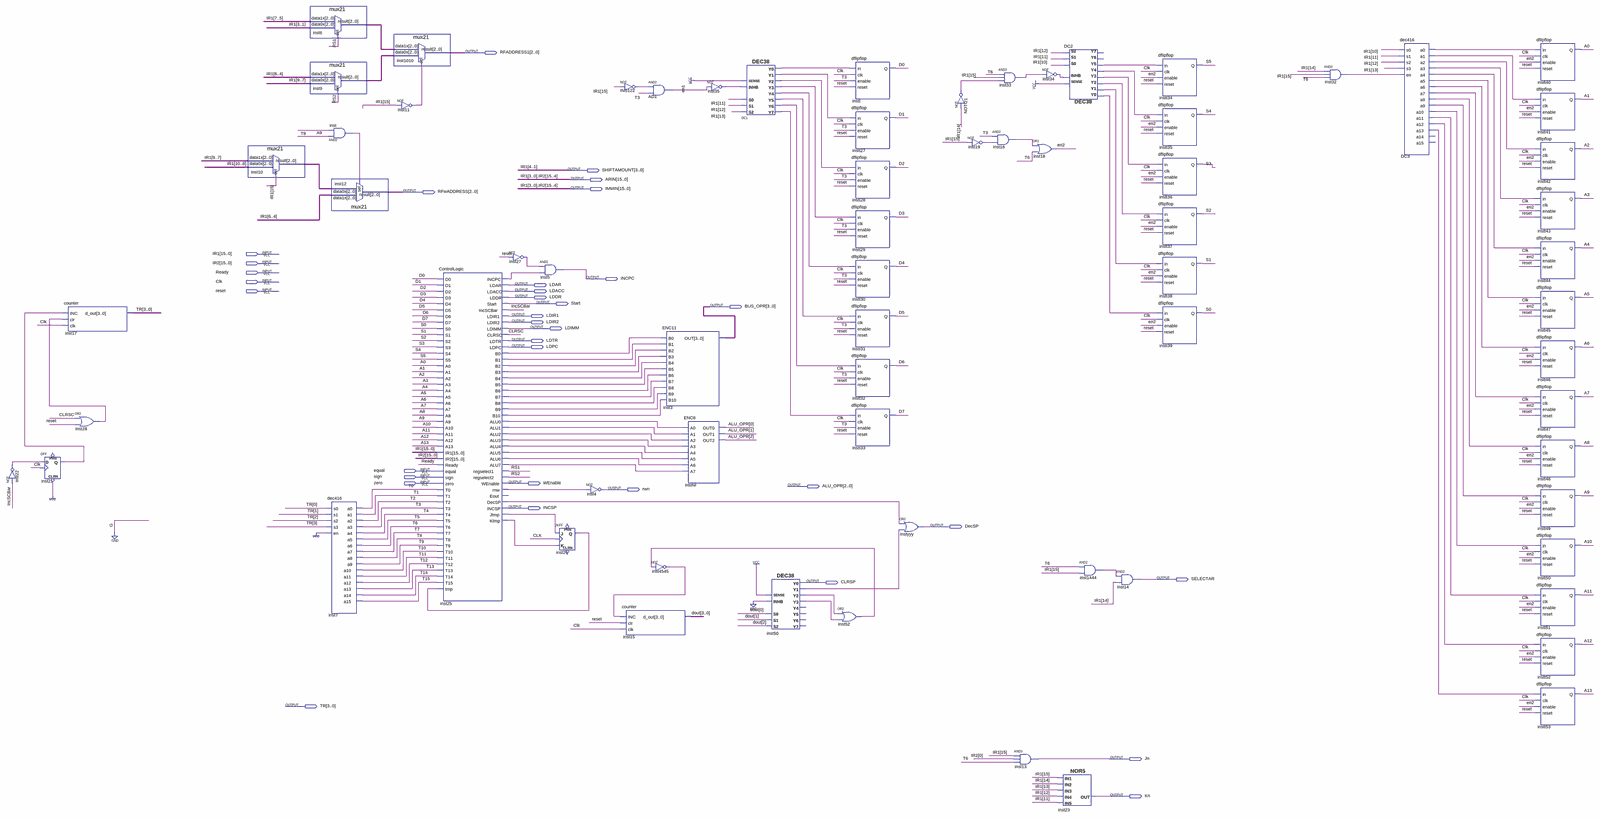
[diagram p0: schematic sheet, whole]
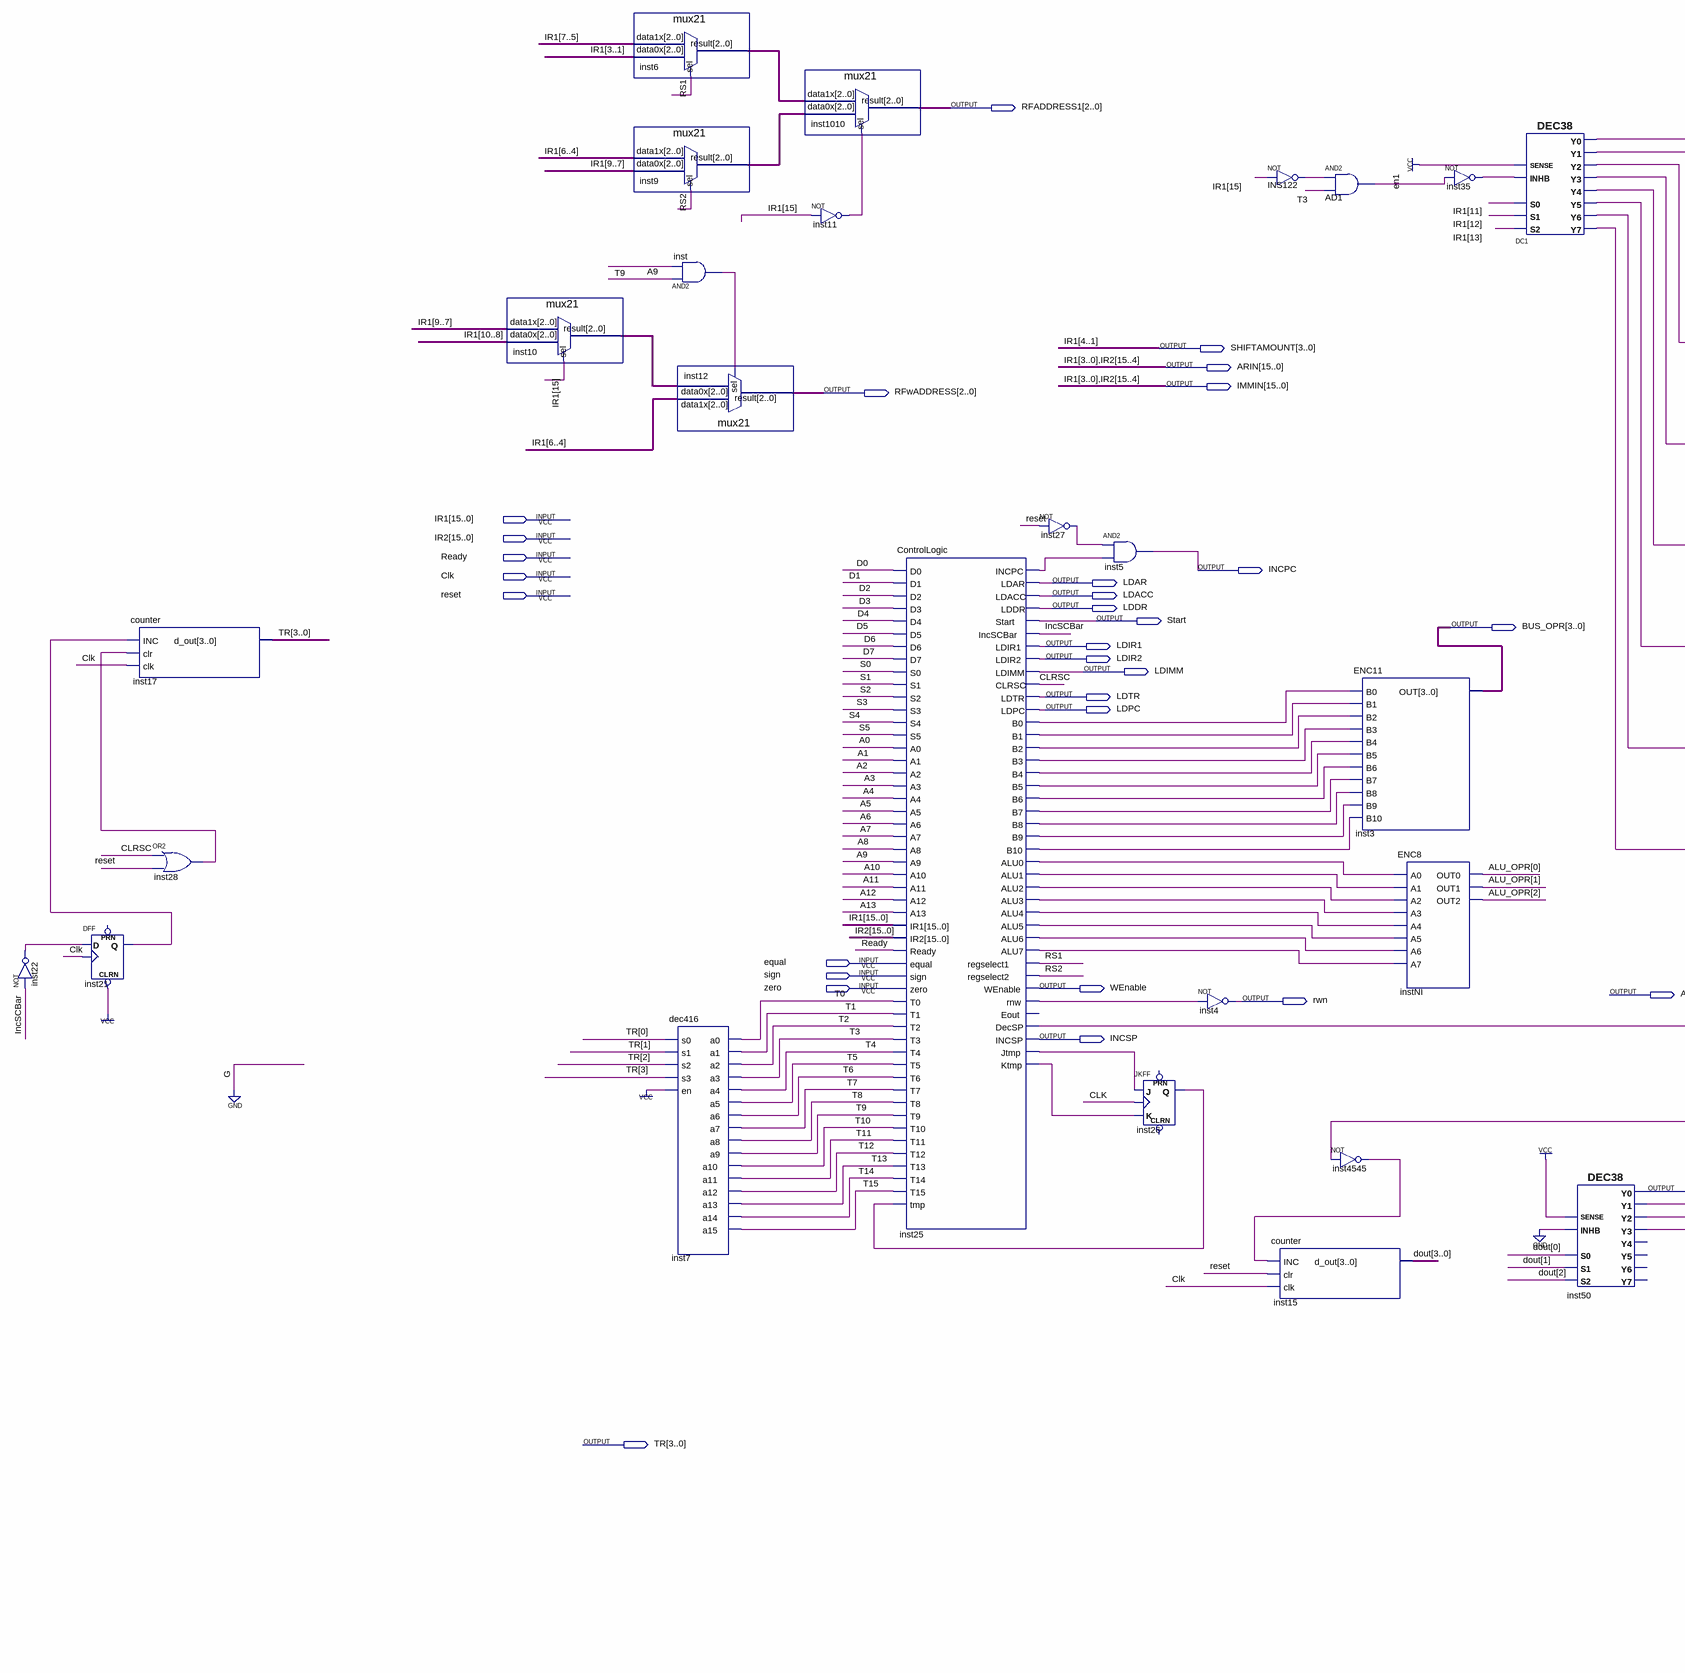
[diagram p1: schematic sheet, left part]
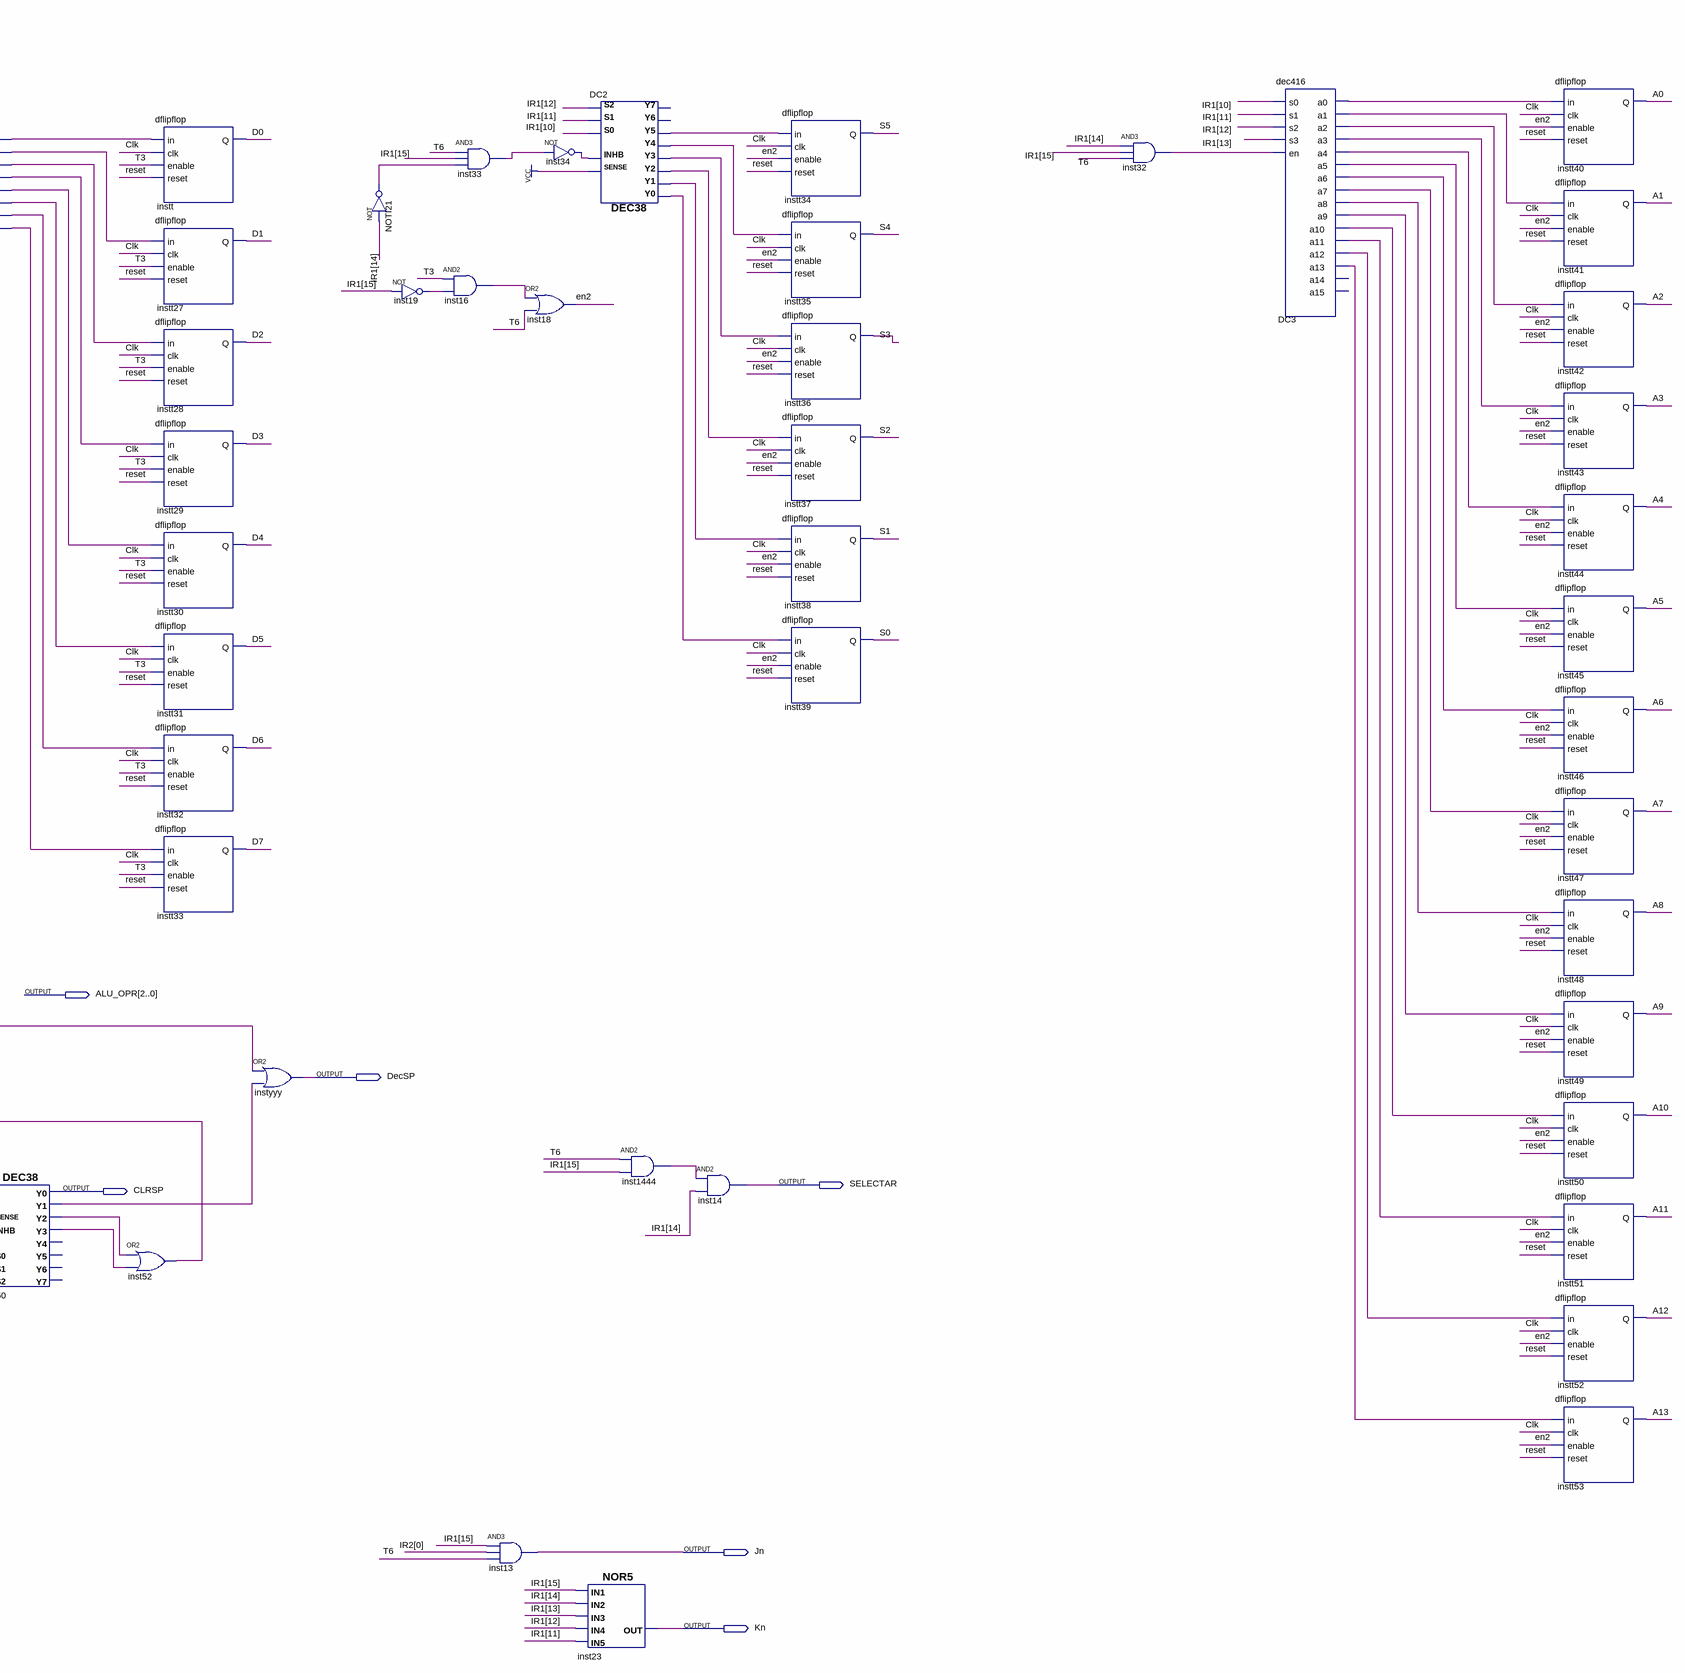
[diagram p2: schematic sheet, right part]
// Quartus schematic ControlUnit.bdf as structural Verilog: 69 symbols, 34 pins
module ControlUnit (
  input  [15:0] IR1,
  input  [15:0] IR2,
  input  Ready,
  input  Clk,
  input  reset,
  input  equal,
  input  sign,
  input  zero,
  output [2:0] RFADDRESS1,
  output [3:0] SHIFTAMOUNT,
  output [15:0] ARIN,
  output [15:0] IMMIN,
  output [2:0] RFwADDRESS,
  output INCPC,
  output LDAR,
  output LDACC,
  output LDDR,
  output Start,
  output [3:0] BUS_OPR,
  output LDIR1,
  output LDIR2,
  output LDIMM,
  output LDTR,
  output LDPC,
  output WEnable,
  output [2:0] ALU_OPR,
  output rwn,
  output INCSP,
  output DecSP,
  output SELECTAR,
  output CLRSP,
  output [3:0] TR,
  output Jn,
  output Kn
);

  wire A0, A1, A2, A3, A4, A5, A6, A7, A8, A9, A10, A11, A12, A13, CLRSC, D0, D1, D2, D3, D4, D5, D6, D7,
       DC1_y0, DC1_y1, DC1_y2, DC1_y3, DC1_y4, DC1_y5, DC1_y6, DC1_y7, DC2_y0, DC2_y1, DC2_y2, DC2_y3,
       DC2_y4, DC2_y5, DC3_a0, DC3_a1, DC3_a2, DC3_a3, DC3_a4, DC3_a5, DC3_a6, DC3_a7, DC3_a8, DC3_a9,
       DC3_a10, DC3_a11, DC3_a12, DC3_a13, en1, en2, IncSCBar, INS122_out, inst11_out, inst16_out,
       inst19_out, inst21_q, inst22_out, inst25_alu0, inst25_alu1, inst25_alu2, inst25_alu3, inst25_alu4,
       inst25_alu5, inst25_alu6, inst25_alu7, inst25_b0, inst25_b1, inst25_b2, inst25_b3, inst25_b4,
       inst25_b5, inst25_b6, inst25_b7, inst25_b8, inst25_b9, inst25_b10, inst25_decsp, inst25_incpc,
       inst25_jtmp, inst25_ktmp, inst25_rnw, inst26_q, inst27_out, inst28_out, inst32_out, inst33_out,
       inst34_out, inst35_out, inst50_y1, inst50_y2, inst50_y3, inst52_out, inst1444_out, inst4545_out,
       inst_out, NOTI21_out, RS1, RS2, S0, S1, S2, S3, S4, S5, T0, T1, T2, T3, T4, T5, T6, T7, T8, T9, T10,
       T11, T12, T13, T14, T15;
  wire [2:0] inst6_result, inst9_result, inst10_result;
  wire [3:0] dout;

  not inst22 (inst22_out, IncSCBar);
  DFF inst21 (.CLRN(1'b1), .CLK(Clk), .D(inst22_out), .Q(inst21_q));  // open: PRN
  counter inst17 (.INC(inst21_q), .clr(inst28_out), .clk(Clk), .d_out(TR));
  or inst28 (inst28_out, CLRSC, reset);
  mux21 inst10 (.data1x(IR1[9:7]), .data0x(IR1[10:8]), .sel(IR1[15]), .result(inst10_result));
  mux21 inst6 (.data1x(IR1[7:5]), .data0x(IR1[3:1]), .sel(RS1), .result(inst6_result));
  mux21 inst9 (.data1x(IR1[6:4]), .data0x(IR1[9:7]), .sel(RS2), .result(inst9_result));
  and inst (inst_out, A9, T9);
  mux21 inst12 (.data1x(IR1[6:4]), .data0x(inst10_result), .sel(inst_out), .result(RFwADDRESS));
  dec416 inst7 (
    .s0(TR[0]), .s1(TR[1]), .s2(TR[2]), .s3(TR[3]), .en(1'b1), .a0(T0), .a1(T1), .a2(T2), .a3(T3), .a4(T4),
    .a5(T5), .a6(T6), .a7(T7), .a8(T8), .a9(T9), .a10(T10), .a11(T11), .a12(T12), .a13(T13), .a14(T14),
    .a15(T15));
  mux21 inst1010 (.data1x(inst6_result), .data0x(inst9_result), .sel(inst11_out), .result(RFADDRESS1));
  not inst11 (inst11_out, IR1[15]);
  ControlLogic inst25 (
    .D0(D0), .D1(D1), .D2(D2), .D3(D3), .D4(D4), .D5(D5), .D6(D6), .D7(D7), .S0(S0), .S1(S1), .S2(S2),
    .S3(S3), .S4(S4), .S5(S5), .A0(A0), .A1(A1), .A2(A2), .A3(A3), .A4(A4), .A5(A5), .A6(A6), .A7(A7),
    .A8(A8), .A9(A9), .A10(A10), .A11(A11), .A12(A12), .A13(A13), .IR1(IR1), .IR2(IR2), .Ready(Ready),
    .equal(equal), .sign(sign), .zero(zero), .T0(T0), .T1(T1), .T2(T2), .T3(T3), .T4(T4), .T5(T5), .T6(T6),
    .T7(T7), .T8(T8), .T9(T9), .T10(T10), .T11(T11), .T12(T12), .T13(T13), .T14(T14), .T15(T15),
    .tmp(inst26_q), .INCPC(inst25_incpc), .LDAR(LDAR), .LDACC(LDACC), .LDDR(LDDR), .Start(Start),
    .IncSCBar(IncSCBar), .LDIR1(LDIR1), .LDIR2(LDIR2), .LDIMM(LDIMM), .CLRSC(CLRSC), .LDTR(LDTR),
    .LDPC(LDPC), .B0(inst25_b0), .B1(inst25_b1), .B2(inst25_b2), .B3(inst25_b3), .B4(inst25_b4),
    .B5(inst25_b5), .B6(inst25_b6), .B7(inst25_b7), .B8(inst25_b8), .B9(inst25_b9), .B10(inst25_b10),
    .ALU0(inst25_alu0), .ALU1(inst25_alu1), .ALU2(inst25_alu2), .ALU3(inst25_alu3), .ALU4(inst25_alu4),
    .ALU5(inst25_alu5), .ALU6(inst25_alu6), .ALU7(inst25_alu7), .regselect1(RS1), .regselect2(RS2),
    .WEnable(WEnable), .rnw(inst25_rnw), .DecSP(inst25_decsp), .INCSP(INCSP), .Jtmp(inst25_jtmp),
    .Ktmp(inst25_ktmp));  // open: Eout
  not inst27 (inst27_out, reset);
  and inst5 (INCPC, inst27_out, inst25_incpc);
  JKFF inst26 (.K(inst25_ktmp), .J(inst25_jtmp), .CLK(Clk), .Q(inst26_q));  // open: PRN, CLRN
  not inst4 (rwn, inst25_rnw);
  not INS122 (INS122_out, IR1[15]);
  counter inst15 (.INC(inst4545_out), .clr(reset), .clk(Clk), .d_out(dout));
  and AD1 (en1, INS122_out, T3);
  ENC11 inst3 (
    .B0(inst25_b0), .B1(inst25_b1), .B2(inst25_b2), .B3(inst25_b3), .B4(inst25_b4), .B5(inst25_b5),
    .B6(inst25_b6), .B7(inst25_b7), .B8(inst25_b8), .B9(inst25_b9), .B10(inst25_b10), .OUT(BUS_OPR));
  not inst4545 (inst4545_out, inst52_out);
  ENC8 instNI (
    .A0(inst25_alu0), .A1(inst25_alu1), .A2(inst25_alu2), .A3(inst25_alu3), .A4(inst25_alu4),
    .A5(inst25_alu5), .A6(inst25_alu6), .A7(inst25_alu7), .OUT0(ALU_OPR[0]), .OUT1(ALU_OPR[1]),
    .OUT2(ALU_OPR[2]));
  not inst35 (inst35_out, en1);
  DEC38 DC1 (
    .S2(IR1[13]), .S1(IR1[12]), .INHB(inst35_out), .S0(IR1[11]), .SENSE(1'b1), .Y7(DC1_y7), .Y6(DC1_y6),
    .Y5(DC1_y5), .Y3(DC1_y3), .Y4(DC1_y4), .Y0(DC1_y0), .Y1(DC1_y1), .Y2(DC1_y2));
  DEC38 inst50 (
    .S2(dout[2]), .S1(dout[1]), .INHB(1'b0), .S0(dout[0]), .SENSE(1'b1), .Y3(inst50_y3), .Y0(CLRSP),
    .Y1(inst50_y1), .Y2(inst50_y2));  // open: Y7, Y6, Y5, Y4
  or inst52 (inst52_out, inst50_y2, inst50_y3);
  dflipflop instt (.in(DC1_y0), .clk(Clk), .enable(T3), .reset(reset), .Q(D0));
  dflipflop instt27 (.in(DC1_y1), .clk(Clk), .enable(T3), .reset(reset), .Q(D1));
  dflipflop instt28 (.in(DC1_y2), .clk(Clk), .enable(T3), .reset(reset), .Q(D2));
  dflipflop instt29 (.in(DC1_y3), .clk(Clk), .enable(T3), .reset(reset), .Q(D3));
  dflipflop instt30 (.in(DC1_y4), .clk(Clk), .enable(T3), .reset(reset), .Q(D4));
  dflipflop instt31 (.in(DC1_y5), .clk(Clk), .enable(T3), .reset(reset), .Q(D5));
  dflipflop instt32 (.in(DC1_y6), .clk(Clk), .enable(T3), .reset(reset), .Q(D6));
  dflipflop instt33 (.in(DC1_y7), .clk(Clk), .enable(T3), .reset(reset), .Q(D7));
  or instyyy (DecSP, inst25_decsp, inst50_y1);
  not NOTI21 (NOTI21_out, IR1[14]);
  not inst19 (inst19_out, IR1[15]);
  and inst33 (inst33_out, T6, IR1[15], NOTI21_out);
  and inst16 (inst16_out, T3, inst19_out);
  and inst13 (Jn, IR1[15], IR2[0], T6);
  or inst18 (en2, inst16_out, T6);
  DEC38 DC2 (
    .S2(IR1[12]), .S1(IR1[11]), .INHB(inst34_out), .S0(IR1[10]), .SENSE(1'b1), .Y5(DC2_y5), .Y3(DC2_y3),
    .Y4(DC2_y4), .Y0(DC2_y0), .Y1(DC2_y1), .Y2(DC2_y2));  // open: Y7, Y6
  not inst34 (inst34_out, inst33_out);
  nor inst23 (Kn, IR1[15], IR1[14], IR1[13], IR1[12], IR1[11]);
  and inst1444 (inst1444_out, T6, IR1[15]);
  and inst14 (SELECTAR, inst1444_out, IR1[14]);
  dflipflop instt34 (.in(DC2_y5), .clk(Clk), .enable(en2), .reset(reset), .Q(S5));
  dflipflop instt35 (.in(DC2_y4), .clk(Clk), .enable(en2), .reset(reset), .Q(S4));
  dflipflop instt36 (.in(DC2_y3), .clk(Clk), .enable(en2), .reset(reset), .Q(S3));
  dflipflop instt37 (.in(DC2_y2), .clk(Clk), .enable(en2), .reset(reset), .Q(S2));
  dflipflop instt38 (.in(DC2_y1), .clk(Clk), .enable(en2), .reset(reset), .Q(S1));
  dflipflop instt39 (.in(DC2_y0), .clk(Clk), .enable(en2), .reset(reset), .Q(S0));
  and inst32 (inst32_out, IR1[14], IR1[15], T6);
  dec416 DC3 (
    .s0(IR1[10]), .s1(IR1[11]), .s2(IR1[12]), .s3(IR1[13]), .en(inst32_out), .a0(DC3_a0), .a1(DC3_a1),
    .a2(DC3_a2), .a3(DC3_a3), .a4(DC3_a4), .a5(DC3_a5), .a6(DC3_a6), .a7(DC3_a7), .a8(DC3_a8), .a9(DC3_a9),
    .a10(DC3_a10), .a11(DC3_a11), .a12(DC3_a12), .a13(DC3_a13));  // open: a14, a15
  dflipflop instt40 (.in(DC3_a0), .clk(Clk), .enable(en2), .reset(reset), .Q(A0));
  dflipflop instt41 (.in(DC3_a1), .clk(Clk), .enable(en2), .reset(reset), .Q(A1));
  dflipflop instt42 (.in(DC3_a2), .clk(Clk), .enable(en2), .reset(reset), .Q(A2));
  dflipflop instt43 (.in(DC3_a3), .clk(Clk), .enable(en2), .reset(reset), .Q(A3));
  dflipflop instt44 (.in(DC3_a4), .clk(Clk), .enable(en2), .reset(reset), .Q(A4));
  dflipflop instt45 (.in(DC3_a5), .clk(Clk), .enable(en2), .reset(reset), .Q(A5));
  dflipflop instt46 (.in(DC3_a6), .clk(Clk), .enable(en2), .reset(reset), .Q(A6));
  dflipflop instt47 (.in(DC3_a7), .clk(Clk), .enable(en2), .reset(reset), .Q(A7));
  dflipflop instt48 (.in(DC3_a8), .clk(Clk), .enable(en2), .reset(reset), .Q(A8));
  dflipflop instt49 (.in(DC3_a9), .clk(Clk), .enable(en2), .reset(reset), .Q(A9));
  dflipflop instt50 (.in(DC3_a10), .clk(Clk), .enable(en2), .reset(reset), .Q(A10));
  dflipflop instt51 (.in(DC3_a11), .clk(Clk), .enable(en2), .reset(reset), .Q(A11));
  dflipflop instt52 (.in(DC3_a12), .clk(Clk), .enable(en2), .reset(reset), .Q(A12));
  dflipflop instt53 (.in(DC3_a13), .clk(Clk), .enable(en2), .reset(reset), .Q(A13));

  assign ARIN = {IR1[3:0], IR2[15:4]};
  assign IMMIN = {IR1[3:0], IR2[15:4]};
  assign SHIFTAMOUNT = IR1[4:1];
endmodule
